# Altium schematic sheet filters.SchDoc
size A; SheetNumber: 1; SheetTotal: 1; SPICEModelCacheWNAWPPTE: <root> / <DocumentId>WNAWPPTE</DocumentId> / <CacheFrame Number="0"> / <Model Name="cap" Kind="MDL"> / <Text>*Default semiconductor capacitor / .MODEL CAP C()</Text> / </Model> / </CacheFrame> / </root>
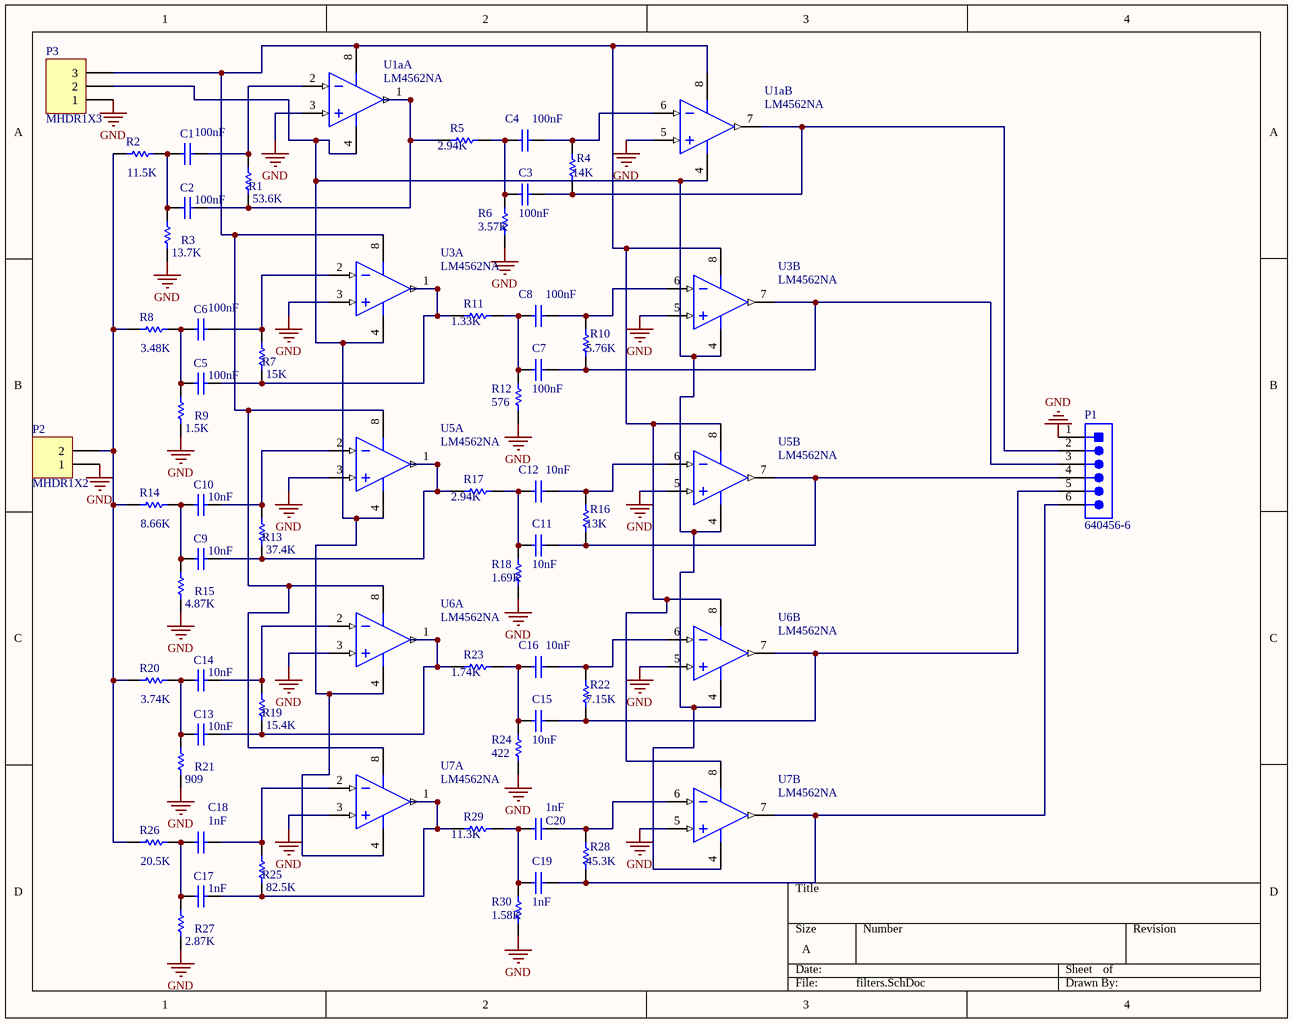
[diagram p0: filters.SchDoc]

## Parts
?  C18  value 1nF  [RAD-0.3]
C1  value 100nF  [RAD-0.3]
C2  value 100nF  [RAD-0.3]
C3  value 100nF  [RAD-0.3]
C4  value 100nF  [RAD-0.3]
C5  value 100nF  [RAD-0.3]
C6  (no value)  [RAD-0.3]
C7  value 100nF  [RAD-0.3]
C8  value 100nF  [RAD-0.3]
C9  value 10nF  [RAD-0.3]
C10  value 10nF  [RAD-0.3]
C11  value 10nF  [RAD-0.3]
C12  value 10nF  [RAD-0.3]
C13  value 10nF  [RAD-0.3]
C14  value 10nF  [RAD-0.3]
C15  value 10nF  [RAD-0.3]
C16  value 10nF  [RAD-0.3]
C17  value 1nF  [RAD-0.3]
C19  value 1nF  [RAD-0.3]
C20  value 1nF  [RAD-0.3]
P1  640456-6  [TECO-640456-6_V]
P2  MHDR1X2  [MHDR1X2]
P3  MHDR1X3  [MHDR1X3]
R1  value 53.6K  [AXIAL-0.3]
R2  value 11.5K  [AXIAL-0.3]
R3  value 13.7K  [AXIAL-0.3]
R4  value 14K  [AXIAL-0.3]
R5  value 2.94K  [AXIAL-0.3]
R6  value 3.57K  [AXIAL-0.3]
R7  value 15K  [AXIAL-0.3]
R8  value 3.48K  [AXIAL-0.3]
R9  value 1.5K  [AXIAL-0.3]
R10  value 5.76K  [AXIAL-0.3]
R11  value 1.33K  [AXIAL-0.3]
R12  value 576  [AXIAL-0.3]
R13  value 37.4K  [AXIAL-0.3]
R14  value 8.66K  [AXIAL-0.3]
R15  value 4.87K  [AXIAL-0.3]
R16  value 13K  [AXIAL-0.3]
R17  value 2.94K  [AXIAL-0.3]
R18  value 1.69K  [AXIAL-0.3]
R19  value 15.4K  [AXIAL-0.3]
R20  value 3.74K  [AXIAL-0.3]
R21  value 909  [AXIAL-0.3]
R22  value 7.15K  [AXIAL-0.3]
R23  value 1.74K  [AXIAL-0.3]
R24  value 422  [AXIAL-0.3]
R25  value 82.5K  [AXIAL-0.3]
R26  value 20.5K  [AXIAL-0.3]
R27  value 2.87K  [AXIAL-0.3]
R28  value 45.3K  [AXIAL-0.3]
R29  value 11.3K  [AXIAL-0.3]
R30  value 1.58K  [AXIAL-0.3]
U1a  LM4562NA  [N08E]  (parts A,B of 2)
U3  LM4562NA  [N08E]  (parts A,B of 2)
U5  LM4562NA  [N08E]  (parts A,B of 2)
U6  LM4562NA  [N08E]  (parts A,B of 2)
U7  LM4562NA  [N08E]  (parts A,B of 2)

## Nets
GND: P1.1 P2.1 P3.1 R3.1 R6.2 R9.1 R12.2 R15.1 R18.2 R21.1 R24.2 R27.1 R30.2 U1a.3(IN_A) U1a.5(IN_B) U3.3(IN_A) U3.5(IN_B) U5.3(IN_A) U5.5(IN_B) U6.3(IN_A) U6.5(IN_B) U7.3(IN_A) U7.5(IN_B)
Net?_1: ?.1 R25.2 U7.2(IN_A)
Net?_2: ?.2 C17.2 R26.1 R27.2
NetC1_1: C1.1 R1.2 U1a.2(IN_A)
NetC1_2: C1.2 C2.2 R2.1 R3.2
NetC2_1: C2.1 R1.1 R5.2 U1a.1(OUT_A)
NetC3_1: C3.1 P1.2 R4.2 U1a.7(OUT_B)
NetC3_2: C3.2 C4.2 R5.1 R6.1
NetC4_1: C4.1 R4.1 U1a.6(IN_B)
NetC5_1: C5.1 R7.1 R11.2 U3.1(OUT_A)
NetC5_2: C5.2 C6.2 R8.1 R9.2
NetC6_1: C6.1 R7.2 U3.2(IN_A)
NetC7_1: C7.1 P1.3 R10.2 U3.7(OUT_B)
NetC7_2: C7.2 C8.2 R11.1 R12.1
NetC8_1: C8.1 R10.1 U3.6(IN_B)
NetC9_1: C9.1 R13.1 R17.2 U5.1(OUT_A)
NetC9_2: C9.2 C10.2 R14.1 R15.2
NetC10_1: C10.1 R13.2 U5.2(IN_A)
NetC11_1: C11.1 P1.4 R16.2 U5.7(OUT_B)
NetC11_2: C11.2 C12.2 R17.1 R18.1
NetC12_1: C12.1 R16.1 U5.6(IN_B)
NetC13_1: C13.1 R19.1 R23.2 U6.1(OUT_A)
NetC13_2: C13.2 C14.2 R20.1 R21.2
NetC14_1: C14.1 R19.2 U6.2(IN_A)
NetC15_1: C15.1 P1.5 R22.2 U6.7(OUT_B)
NetC15_2: C15.2 C16.2 R23.1 R24.1
NetC16_1: C16.1 R22.1 U6.6(IN_B)
NetC17_1: C17.1 R25.1 R29.2 U7.1(OUT_A)
NetC19_1: C19.1 P1.6 R28.2 U7.7(OUT_B)
NetC19_2: C19.2 C20.2 R29.1 R30.1
NetC20_1: C20.1 R28.1 U7.6(IN_B)
NetP2_2: P2.2 R2.2 R8.2 R14.2 R20.2 R26.2
NetP3_2: P3.2 U1a.4(V-) U3.4(V-) U5.4(V-) U6.4(V-) U7.4(V-)
NetP3_3: P3.3 U1a.8(V+) U3.8(V+) U5.8(V+) U6.8(V+) U7.8(V+)

## Notes on the sheet
- (in symbol Cap) 100nF

## Library data of the parts
? C1-C17 C19 C20 = Cap: Capacitor; Published: 8-Jun-2000; LatestRevisionDate: 17-Jul-2002; LatestRevisionNote: Re-released for DXP Platform.; PackageReference: RAD-0.3; Publisher: Altium Limited; PackageDescription: Radial Cap, Thru-Hole; 2 Leads; 0.3 in Pin Spacing
P1 = CMP-2000-05661-1: Male Header, Pitch 2.54 mm, 1 x 6 Position, Height 10.03 mm, Tail Length 3.56 mm, -55 to 105 degC, Bulk; Manufacturer: TE Connectivity; Contact Centerline Spacing: 0.100 / in.; Number of Contacts: 6; Current, Rating: 5 / A; Agency Approvals: CSA,UL; Material, Contact: CopperAlloy; Mounting Hole Size: 0.04 / "; Brand/Series: MTA-100Series; Pin Spacing: 0.1 / "; Mount Angle: Vertical; Contact Termination Area Plating: Tin; Angle: Straight; Primary Type: InterconnectSystem; Standards: RoHSCompliant,ELVCompliant,UL94V-0; Temperature, Operating: -55to+105 / °C; Material, Housing: Polyester; Special Features: Pinstrip; Color, Housing: White; Connector Type: MTA-100; Voltage, Rating: 250 / V; Termination: Solder; Package Reference: 640456-6; Size, Post: 0.025 / in.; Color: White; Datasheet URL: https://datasheet.ciiva.com/25618/0900766b80eb7fdd-25618163.pdf; Manufacturer URL: http://www.te.com/; Mounting Type: PCMount; Length, Pin: 0.14 / "; Type: PCBPlug; Length, Overall: 0.6 / "; Mounting Technology: ThroughHole; Number of Rows: 1; Contact Shape: Square; Contact Mating Area Plating: Tin; Datasheet Version: Rev. W, 05/2005; Number of Positions: 6; Package Description: Male Header, Pitch 2.54 mm, 1 x 6 Position, Height 10.03 mm, Tail Length 3.56 mm; Contact Plating: Tin; Length, Terminal Post: 0.14 / in.; Flammability Rating: UL94V-0
P2 = MHDR1X2: Header, 2-Pin; LatestRevisionDate: 17-Jul-2002; LatestRevisionNote: Re-released for DXP Platform.; Publisher: Altium Limited
P3 = MHDR1X3: Header, 3-Pin; LatestRevisionDate: 17-Jul-2002; LatestRevisionNote: Re-released for DXP Platform.; Publisher: Altium Limited
R1-R30 = Res1: Resistor; Published: 8-Jun-2000; LatestRevisionDate: 17-Jul-2002; LatestRevisionNote: Re-released for DXP Platform.; PackageReference: AXIAL-0.3; Publisher: Altium Limited; PackageDescription: Axial Device, Thru-Hole; 2 Leads; 0.3 in Pin Spacing
U1a U3 U5-U7 = CMP-0057-00043-2: Dual High Performance, High Fidelity Audio Operational Amplifier, 8-pin MDIP; Manufacturer: National Semiconductor; PowerWise: Y; PackageTopMarking: NSUZXYTT*LM*4562NA; CompType: Audio IC; ComponentLink2Description: LM4562 Web Page; PinCount: 8; RoHS: Y; PackageReference: N08E; DatasheetVersion: Jan-2010; RevisionNote: Component URLs added; PackageVersion: revG, May-2006; Code_JEDEC: MS-001-BA; ComponentLink3URL: http://www.national.com/packaging/folders/n08e.html; ComponentLink1Description: LM4562 Datasheet; PackageDescription: MDIP, .365 x .250 x .130in, 8 Lead, .100in Pitch; ComponentLink3Description: N08E Package Page; ComponentLink1URL: http://www.national.com/ds/LM/LM4562.pdf; ComponentLink2URL: http://www.national.com/pf/LM/LM4562.html